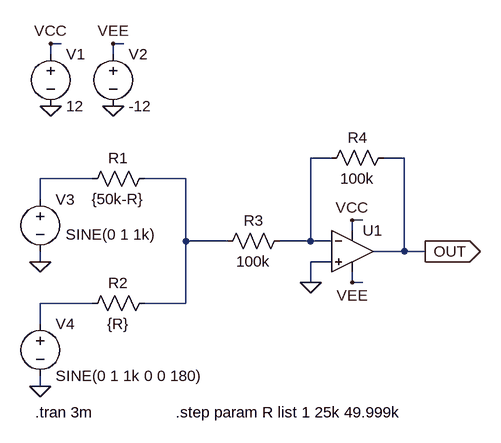
[diagram p0: schematic Dry_Wet_FV-1_NoFilter_Dual_Buffered_Test_01.asc]
Dry_Wet_FV-1_NoFilter_Dual_Buffered_Test_01.asc, the LTspice schematic file:
Version 4
SHEET 1 880 680
WIRE 16 -128 0 -128
WIRE 112 -128 96 -128
WIRE 0 -112 0 -128
WIRE 96 -112 96 -128
WIRE 432 48 400 48
WIRE 544 48 512 48
WIRE 64 80 -16 80
WIRE 208 80 144 80
WIRE -16 112 -16 80
WIRE 480 144 464 144
WIRE 464 160 464 144
WIRE 208 176 208 80
WIRE 272 176 208 176
WIRE 400 176 400 48
WIRE 400 176 352 176
WIRE 432 176 400 176
WIRE 544 192 544 48
WIRE 544 192 496 192
WIRE 576 192 544 192
WIRE -16 208 -16 192
WIRE 432 208 400 208
WIRE 400 240 400 208
WIRE 464 240 464 224
WIRE 480 240 464 240
WIRE 64 272 -16 272
WIRE 208 272 208 176
WIRE 208 272 144 272
WIRE -16 304 -16 272
WIRE -16 400 -16 384
FLAG 464 144 VCC
FLAG 464 240 VEE
FLAG 400 240 0
FLAG 576 192 OUT
IOPIN 576 192 Out
FLAG 0 -32 0
FLAG 96 -32 0
FLAG 0 -128 VCC
FLAG 96 -128 VEE
FLAG -16 208 0
FLAG -16 400 0
SYMBOL res 160 64 R90
WINDOW 0 0 56 VBottom 2
WINDOW 3 32 56 VTop 2
SYMATTR InstName R1
SYMATTR Value {50k-R}
SYMBOL res 160 256 R90
WINDOW 0 0 56 VBottom 2
WINDOW 3 32 56 VTop 2
SYMATTR InstName R2
SYMATTR Value {R}
SYMBOL res 368 160 R90
WINDOW 0 0 56 VBottom 2
WINDOW 3 32 56 VTop 2
SYMATTR InstName R3
SYMATTR Value 100k
SYMBOL Opamps\\UniversalOpamp2 464 192 R0
SYMATTR InstName U1
SYMBOL res 528 32 R90
WINDOW 0 0 56 VBottom 2
WINDOW 3 32 56 VTop 2
SYMATTR InstName R4
SYMATTR Value 100k
SYMBOL voltage 0 -128 R0
WINDOW 123 0 0 Left 0
WINDOW 39 0 0 Left 0
SYMATTR InstName V1
SYMATTR Value 12
SYMBOL voltage 96 -128 R0
WINDOW 123 0 0 Left 0
WINDOW 39 0 0 Left 0
SYMATTR InstName V2
SYMATTR Value -12
SYMBOL voltage -16 96 R0
WINDOW 123 0 0 Left 0
WINDOW 39 0 0 Left 0
WINDOW 3 39 70 Left 2
SYMATTR Value SINE(0 1 1k)
SYMATTR InstName V3
SYMBOL voltage -16 288 R0
WINDOW 123 0 0 Left 0
WINDOW 39 0 0 Left 0
SYMATTR InstName V4
SYMATTR Value SINE(0 1 1k 0 0 180)
TEXT -24 440 Left 2 !.tran 3m
TEXT 192 440 Left 2 !.step param R list 1 25k 49.999k

The netlist it stands for:
* Dry_Wet_FV-1_NoFilter_Dual_Buffered_Test_01.asc
R1 N003 N002 {50k-R}
R2 N003 N004 {R}
R3 N001 N003 100k
XU1 0 N001 VCC VEE OUT level.2 Avol=1Meg GBW=10Meg Slew=10Meg ilimit=25m rail=0 Vos=0 phimargin=45 en=0 enk=0 in=0 ink=0 Rin=500Meg  ; pins IN+ IN- V+ V- OUT
R4 OUT N001 100k
V1 VCC 0 12
V2 VEE 0 -12
V3 N002 0 SINE(0 1 1k)
V4 N004 0 SINE(0 1 1k 0 0 180)
.tran 3m
.step param R list 1 25k 49.999k
.lib UniversalOpamps2.sub
.backanno
.end